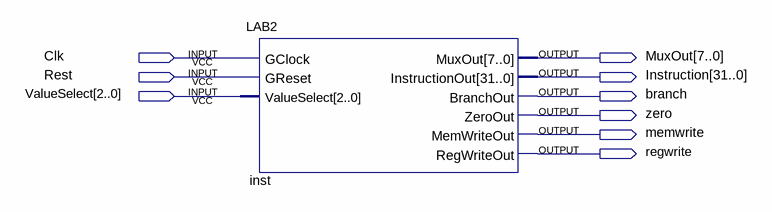
[diagram p0: schematic sheet]
// Quartus schematic Block2.bdf as structural Verilog: 1 symbols, 9 pins
module Block2 (
  input  Clk,
  input  Rest,
  input  [2:0] ValueSelect,
  output [7:0] MuxOut,
  output [31:0] Instruction,
  output branch,
  output zero,
  output memwrite,
  output regwrite
);

  LAB2 inst (
    .GClock(Clk), .GReset(Rest), .ValueSelect(ValueSelect), .MuxOut(MuxOut), .InstructionOut(Instruction),
    .BranchOut(branch), .ZeroOut(zero), .MemWriteOut(memwrite), .RegWriteOut(regwrite));
endmodule
